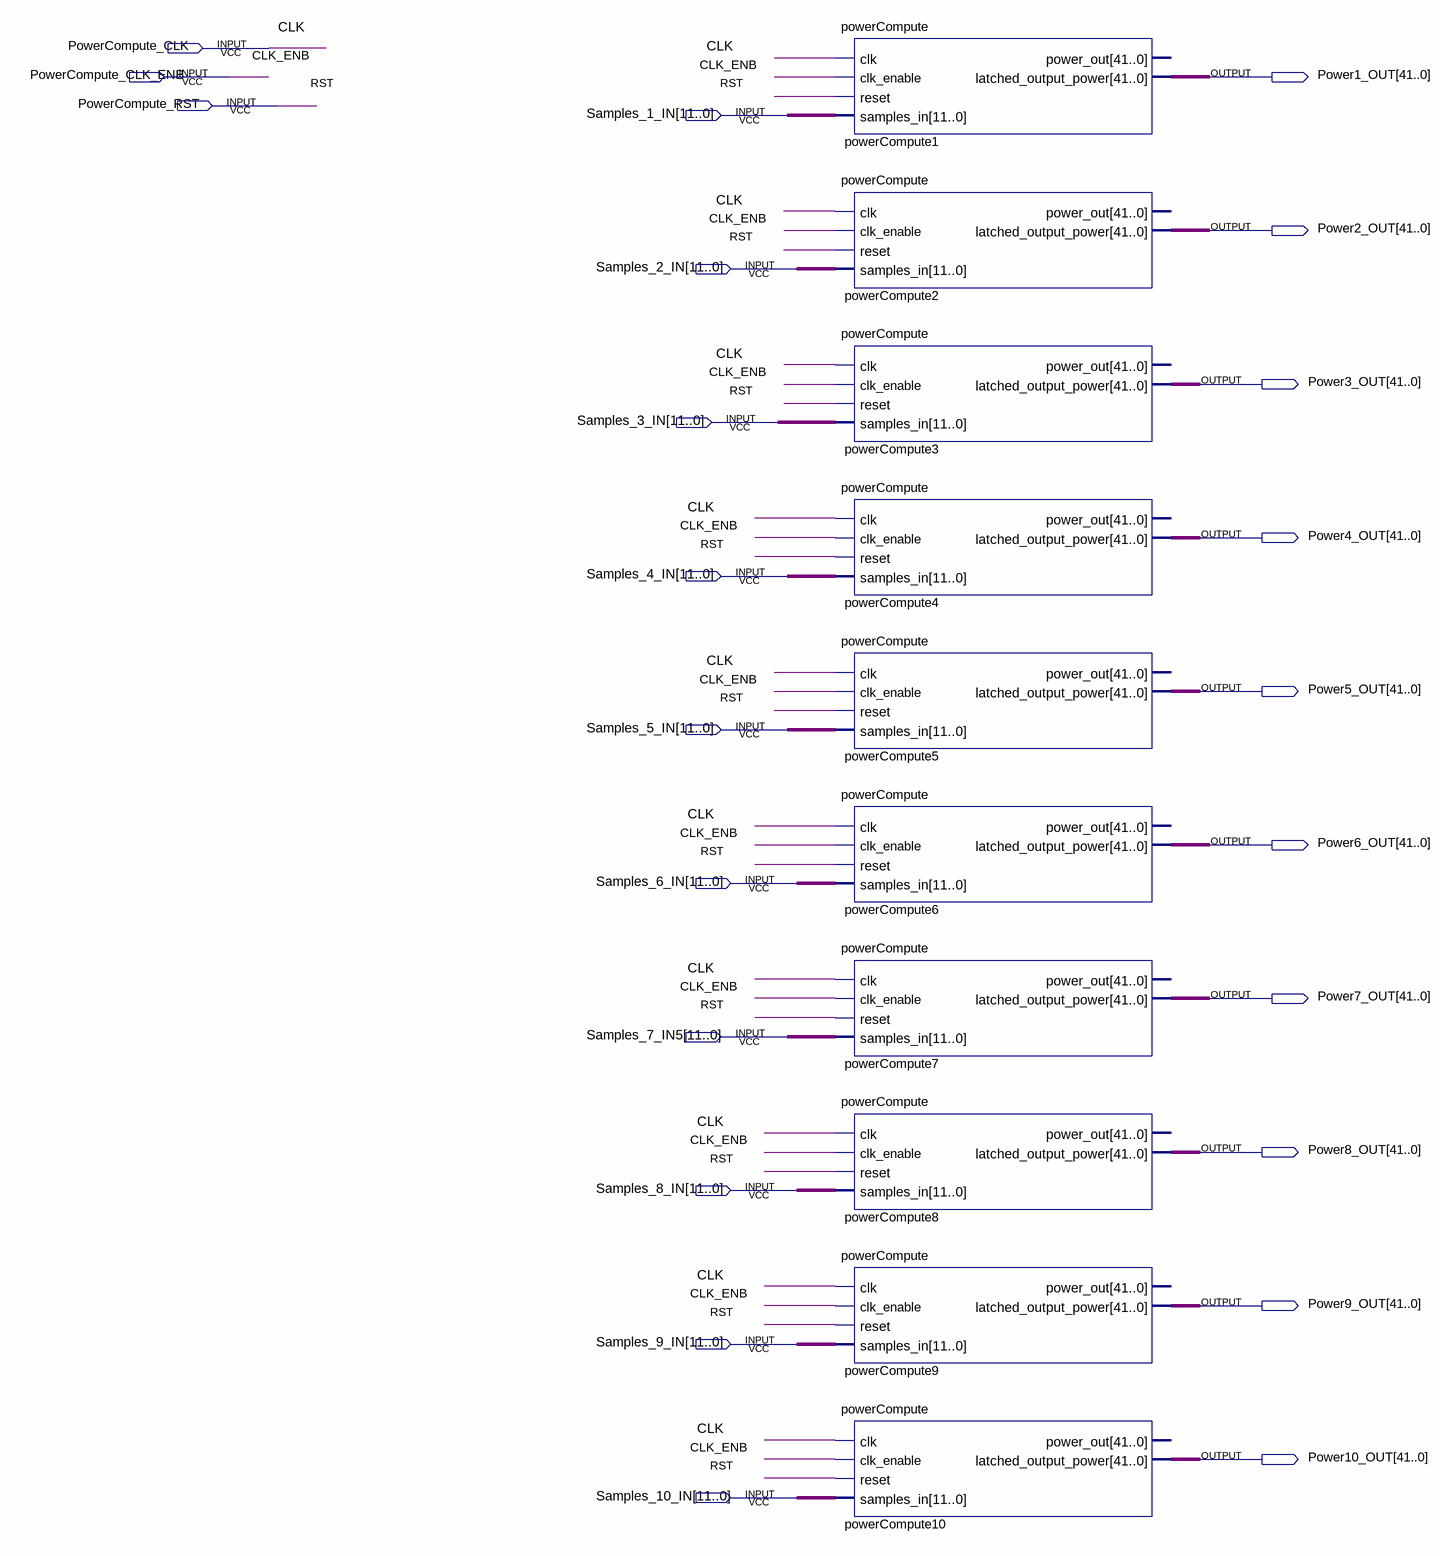
[diagram p0: schematic sheet]
// Quartus schematic PowerCalculator.bdf as structural Verilog: 10 symbols, 23 pins
module PowerCalculator (
  input  PowerCompute_CLK,
  input  PowerCompute_CLK_ENB,
  input  PowerCompute_RST,
  input  [11:0] Samples_1_IN,
  input  [11:0] Samples_2_IN,
  input  [11:0] Samples_3_IN,
  input  [11:0] Samples_4_IN,
  input  [11:0] Samples_5_IN,
  input  [11:0] Samples_6_IN,
  input  [11:0] Samples_7_IN5,
  input  [11:0] Samples_8_IN,
  input  [11:0] Samples_9_IN,
  input  [11:0] Samples_10_IN,
  output [41:0] Power1_OUT,
  output [41:0] Power2_OUT,
  output [41:0] Power3_OUT,
  output [41:0] Power4_OUT,
  output [41:0] Power5_OUT,
  output [41:0] Power6_OUT,
  output [41:0] Power7_OUT,
  output [41:0] Power8_OUT,
  output [41:0] Power9_OUT,
  output [41:0] Power10_OUT
);

  powerCompute powerCompute1 (
    .clk(PowerCompute_CLK), .clk_enable(PowerCompute_CLK_ENB), .reset(PowerCompute_RST),
    .samples_in(Samples_1_IN), .latched_output_power(Power1_OUT));  // open: power_out
  powerCompute powerCompute2 (
    .clk(PowerCompute_CLK), .clk_enable(PowerCompute_CLK_ENB), .reset(PowerCompute_RST),
    .samples_in(Samples_2_IN), .latched_output_power(Power2_OUT));  // open: power_out
  powerCompute powerCompute3 (
    .clk(PowerCompute_CLK), .clk_enable(PowerCompute_CLK_ENB), .reset(PowerCompute_RST),
    .samples_in(Samples_3_IN), .latched_output_power(Power3_OUT));  // open: power_out
  powerCompute powerCompute4 (
    .clk(PowerCompute_CLK), .clk_enable(PowerCompute_CLK_ENB), .reset(PowerCompute_RST),
    .samples_in(Samples_4_IN), .latched_output_power(Power4_OUT));  // open: power_out
  powerCompute powerCompute5 (
    .clk(PowerCompute_CLK), .clk_enable(PowerCompute_CLK_ENB), .reset(PowerCompute_RST),
    .samples_in(Samples_5_IN), .latched_output_power(Power5_OUT));  // open: power_out
  powerCompute powerCompute6 (
    .clk(PowerCompute_CLK), .clk_enable(PowerCompute_CLK_ENB), .reset(PowerCompute_RST),
    .samples_in(Samples_6_IN), .latched_output_power(Power6_OUT));  // open: power_out
  powerCompute powerCompute7 (
    .clk(PowerCompute_CLK), .clk_enable(PowerCompute_CLK_ENB), .reset(PowerCompute_RST),
    .samples_in(Samples_7_IN5), .latched_output_power(Power7_OUT));  // open: power_out
  powerCompute powerCompute8 (
    .clk(PowerCompute_CLK), .clk_enable(PowerCompute_CLK_ENB), .reset(PowerCompute_RST),
    .samples_in(Samples_8_IN), .latched_output_power(Power8_OUT));  // open: power_out
  powerCompute powerCompute9 (
    .clk(PowerCompute_CLK), .clk_enable(PowerCompute_CLK_ENB), .reset(PowerCompute_RST),
    .samples_in(Samples_9_IN), .latched_output_power(Power9_OUT));  // open: power_out
  powerCompute powerCompute10 (
    .clk(PowerCompute_CLK), .clk_enable(PowerCompute_CLK_ENB), .reset(PowerCompute_RST),
    .samples_in(Samples_10_IN), .latched_output_power(Power10_OUT));  // open: power_out

  // Other names for the same wires on the sheet: CLK = PowerCompute_CLK; CLK_ENB = PowerCompute_CLK_ENB;
  //   RST = PowerCompute_RST
endmodule
